# EasyEDA Pro project ProPrj_measure_boardd_2025-04-16.epro

# Schematic Schematic1
Board Name: Board1; Create Date: 2025-02-12; Page Name: P1; Project Name: measure_boardd; Schematic Name: Schematic1; Update Date: 2025-04-13; Company: EasyEDA.com; Page Size: A4; Version: V1.0
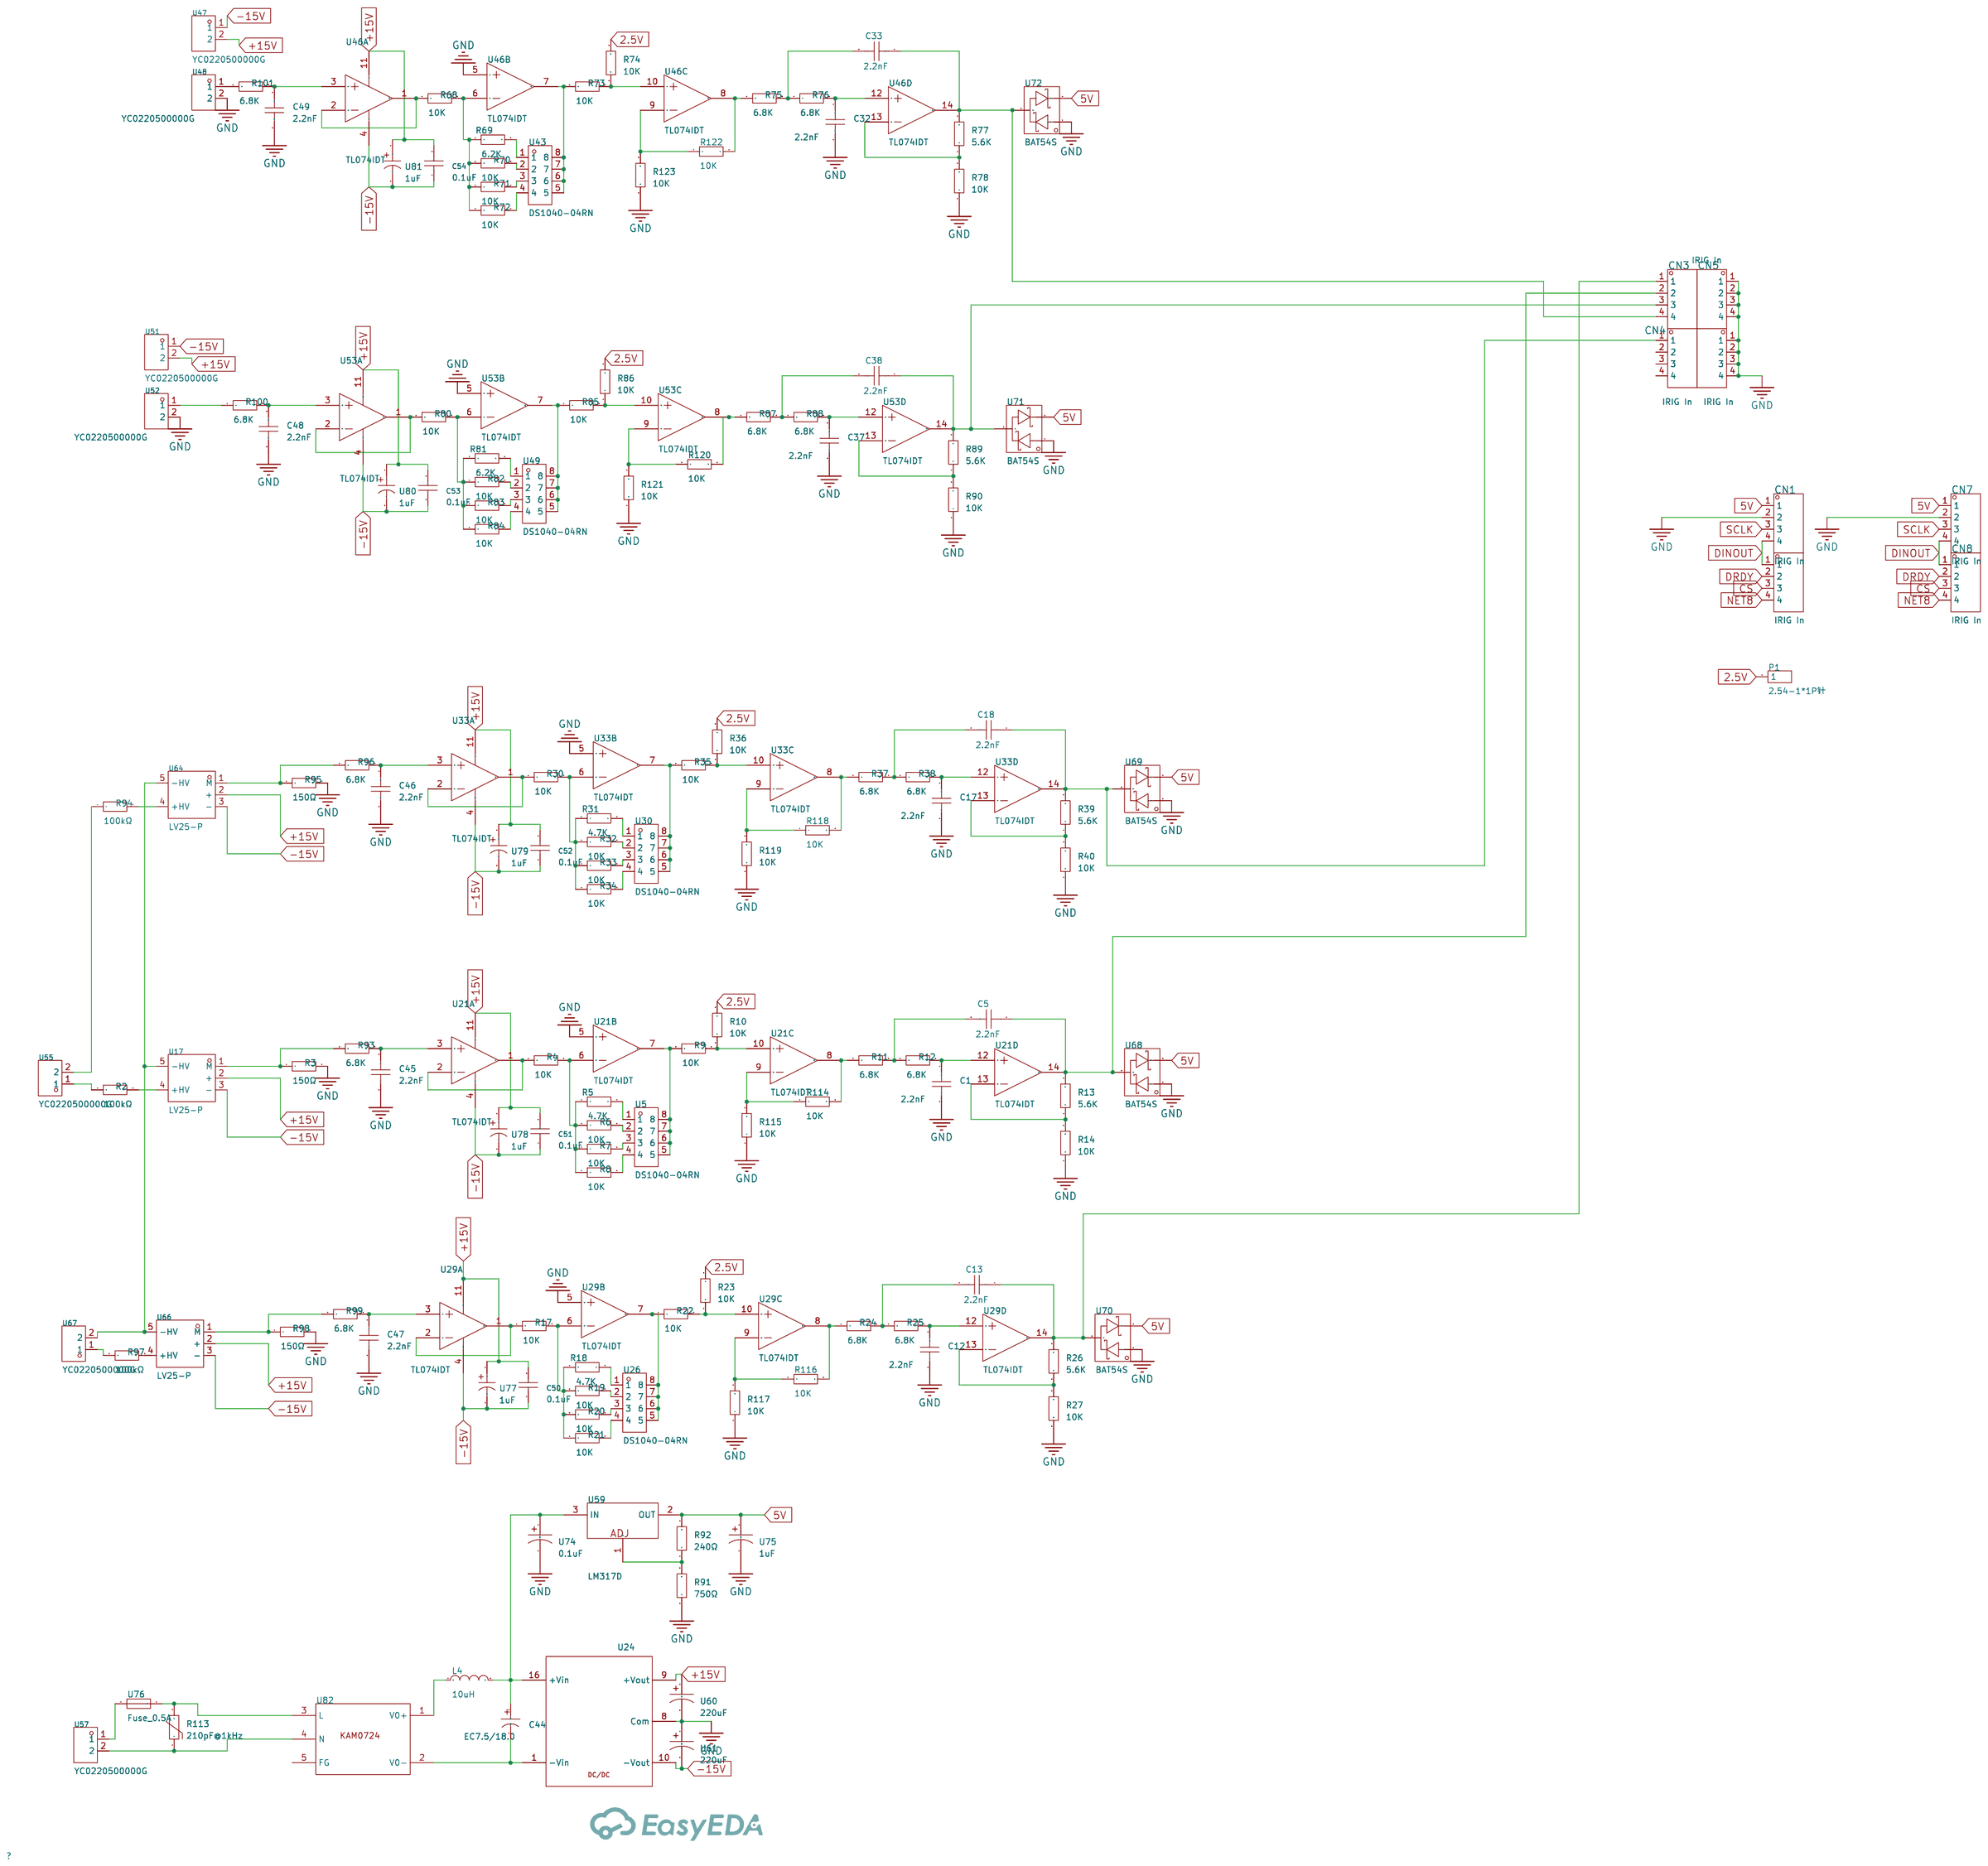
[diagram p0: schematic sheet]

## Parts
C1  2.2nF  [C0805]
C5  2.2nF  [C0805]
C12  2.2nF  [C0805]
C13  2.2nF  [C0805]
C17  2.2nF  [C0805]
C18  2.2nF  [C0805]
C32  2.2nF  [C0805]
C33  2.2nF  [C0805]
C37  2.2nF  [C0805]
C38  2.2nF  [C0805]
C44  EC7.5/18.0  [CAP-TH_BD18.0-P7.50-D1.2-FD]
C45  2.2nF  [C0805]
C46  2.2nF  [C0805]
C47  2.2nF  [C0805]
C48  2.2nF  [C0805]
C49  2.2nF  [C0805]
C50  0.1uF  [C0805]
C51  0.1uF  [C0805]
C52  0.1uF  [C0805]
C53  0.1uF  [C0805]
C54  0.1uF  [C0805]
CN1  IRIG In  [HDR-TH_04P-P2.54-V-M-2]
CN2  IRIG In  [HDR-TH_04P-P2.54-V-M-2]
CN3  IRIG In  [HDR-TH_04P-P2.54-V-M-2]
CN4  IRIG In  [HDR-TH_04P-P2.54-V-M-2]
CN5  IRIG In  [HDR-TH_04P-P2.54-V-M-2]
CN6  IRIG In  [HDR-TH_04P-P2.54-V-M-2]
CN7  IRIG In  [HDR-TH_04P-P2.54-V-M-2]
CN8  IRIG In  [HDR-TH_04P-P2.54-V-M-2]
L4  10uH  [IND-TH_BD9.0-P5.00-D0.7]
P1  2.54-1*1P针  [HDR-TH_1P-P2.54-V-M]
R2  100kΩ  [RES-TH_BD8.0-L24.5-P28.50-D0.8]
R3  150Ω  [R_AXIAL-0.4]
R4  10K  [R0603]
R5  4.7K  [R0603]
R6  10K  [R0603]
R7  10K  [R0603]
R8  10K  [R0603]
R9  10K  [R0603]
R10  10K  [R0603]
R11  6.8K  [R0603]
R12  6.8K  [R0603]
R13  5.6K  [R0603]
R14  10K  [R0603]
R17  10K  [R0603]
R18  4.7K  [R0603]
R19  10K  [R0603]
R20  10K  [R0603]
R21  10K  [R0603]
R22  10K  [R0603]
R23  10K  [R0603]
R24  6.8K  [R0603]
R25  6.8K  [R0603]
R26  5.6K  [R0603]
R27  10K  [R0603]
R30  10K  [R0603]
R31  4.7K  [R0603]
R32  10K  [R0603]
R33  10K  [R0603]
R34  10K  [R0603]
R35  10K  [R0603]
R36  10K  [R0603]
R37  6.8K  [R0603]
R38  6.8K  [R0603]
R39  5.6K  [R0603]
R40  10K  [R0603]
R68  10K  [R0603]
R69  6.2K  [R0603]
R70  10K  [R0603]
R71  10K  [R0603]
R72  10K  [R0603]
R73  10K  [R0603]
R74  10K  [R0603]
R75  6.8K  [R0603]
R76  6.8K  [R0603]
R77  5.6K  [R0603]
R78  10K  [R0603]
R80  10K  [R0603]
R81  6.2K  [R0603]
R82  10K  [R0603]
R83  10K  [R0603]
R84  10K  [R0603]
R85  10K  [R0603]
R86  10K  [R0603]
R87  6.8K  [R0603]
R88  6.8K  [R0603]
R89  5.6K  [R0603]
R90  10K  [R0603]
R91  750Ω  [R1210]
R92  240Ω  [R1210]
R93  6.8K  [R0603]
R94  100kΩ  [RES-TH_BD8.0-L24.5-P28.50-D0.8]
R95  150Ω  [R_AXIAL-0.4]
R96  6.8K  [R0603]
R97  100kΩ  [RES-TH_BD8.0-L24.5-P28.50-D0.8]
R98  150Ω  [R_AXIAL-0.4]
R99  6.8K  [R0603]
R100  6.8K  [R0603]
R101  6.8K  [R0603]
R113  210pF@1kHz  [RES-TH_L12.5-W5.1-P7.50-D1.2-S2.20]
R114  10K  [R0603]
R115  10K  [R0603]
R116  10K  [R0603]
R117  10K  [R0603]
R118  10K  [R0603]
R119  10K  [R0603]
R120  10K  [R0603]
R121  10K  [R0603]
R122  10K  [R0603]
R123  10K  [R0603]
U5  DS1040-04RN  [KEY-TH_DS1040-04RN]
U17  LV25-P  [SENSOR-TH_LV25-P]
U21  TL074IDT  [SOIC-14_L8.7-W3.9-P1.27-LS6.0-BL]  (sections 1,2,3,4)
U24  -  [TEL_8_SERIES]
U26  DS1040-04RN  [KEY-TH_DS1040-04RN]
U29  TL074IDT  [SOIC-14_L8.7-W3.9-P1.27-LS6.0-BL]  (sections 1,2,3,4)
U30  DS1040-04RN  [KEY-TH_DS1040-04RN]
U33  TL074IDT  [SOIC-14_L8.7-W3.9-P1.27-LS6.0-BL]  (sections 1,2,3,4)
U43  DS1040-04RN  [KEY-TH_DS1040-04RN]
U46  TL074IDT  [SOIC-14_L8.7-W3.9-P1.27-LS6.0-BL]  (sections 1,2,3,4)
U47  YC0220500000G  [CONN-TH_YC0220500000G]
U48  YC0220500000G  [CONN-TH_YC0220500000G]
U49  DS1040-04RN  [KEY-TH_DS1040-04RN]
U51  YC0220500000G  [CONN-TH_YC0220500000G]
U52  YC0220500000G  [CONN-TH_YC0220500000G]
U53  TL074IDT  [SOIC-14_L8.7-W3.9-P1.27-LS6.0-BL]  (sections 1,2,3,4)
U55  YC0220500000G  [CONN-TH_YC0220500000G]
U57  YC0220500000G  [CONN-TH_YC0220500000G]
U59  LM317D  [TO-252-2_L6.6-W6.1-P4.57-LS9.9-BR-CW]
U60  220uF  [CAP-TH_BD6.3-P2.50-D0.6-FD]
U61  220uF  [CAP-TH_BD6.3-P2.50-D0.6-FD]
U64  LV25-P  [SENSOR-TH_LV25-P]
U66  LV25-P  [SENSOR-TH_LV25-P]
U67  YC0220500000G  [CONN-TH_YC0220500000G]
U68  BAT54S  [SOT-23-3_L2.9-W1.3-P1.90-LS2.4-BR]
U69  BAT54S  [SOT-23-3_L2.9-W1.3-P1.90-LS2.4-BR]
U70  BAT54S  [SOT-23-3_L2.9-W1.3-P1.90-LS2.4-BR]
U71  BAT54S  [SOT-23-3_L2.9-W1.3-P1.90-LS2.4-BR]
U72  BAT54S  [SOT-23-3_L2.9-W1.3-P1.90-LS2.4-BR]
U74  0.1uF  [CAP-TH_BD6.3-P2.50-D0.6-FD]
U75  1uF  [CAP-TH_BD6.3-P2.50-D0.6-FD]
U76  Fuse_0.5A  [FUSE-TH_L8.9-W2.0-P5.00-D0.6-S0.80]
U77  1uF  [CAP-SMD_L3.5-W2.8-FD]
U78  1uF  [CAP-SMD_L3.5-W2.8-FD]
U79  1uF  [CAP-SMD_L3.5-W2.8-FD]
U80  1uF  [CAP-SMD_L3.5-W2.8-FD]
U81  1uF  [CAP-SMD_L3.5-W2.8-FD]
U82  -  [KAM0724]

## Library data of the parts
C1 C5 C12 C13 C17 C18 C32 C33 C37 C38 C45-C49 = CAP_0805: Supplier Footprint: 0805
C44 = EC7.5/18.0: Supplier Part: C9900017020; Supplier Footprint: 1000uF/63V；间距7.5mm外径18mm; JLCPCB Part Class: Extended Part; Supplier: LCSC
C50-C54 = CL21B105KBFNNNE: Capacitance: Tolerance:±10% Tolerance:±10% Voltage Rated: Temperature Coefficient:; LCSC Part Name: 1uF ±10% 50V; Supplier Part: C28323; Manufacturer: SAMSUNG(三星); Supplier Footprint: 0805; JLCPCB Part Class: Basic Part; Datasheet: https://atta.szlcsc.com/upload/public/pdf/source/20160218/1457707763339.pdf; Supplier: LCSC; Tolerance: ±10%
CN1-CN8 = IRIG In: Supplier: LCSC; Manufacturer Part: Headers  Pins2.54mm1*10P; image: http://image.lceda.cn/szlcsc/C57369.jpg; Supplier Part: C57369
L4 = PK0810-100MB: Inductance: Tolerance:±20% Tolerance:±20% Rated Current:3.2A DC Resistance (DCR):; LCSC Part Name: 10uH ±20%; Supplier Part: C19633499; Manufacturer: SXN(顺翔诺); Supplier Footprint: 插件,D9xL13mm; JLCPCB Part Class: Extended Part; Datasheet: https://atta.szlcsc.com/upload/public/pdf/source/20231215/67ADFEC92998B805DD4A41A71DD3C91A.pdf; Supplier: LCSC; Tolerance: ±20%; Rated Current: 3.2A
P1 = 2.54-1*1P针: Pin Structure:- Pitch:- Row Spacing:- Circluar Pins/Square Pins:- Mounting Type:Straight Number of Rows:Single Row Number of Pins:1P Current Rating:- Voltage Rating (Max):- Length of Mating Pin:- Insulation Height:- Contact Material:- Contact Plating:- Co; LCSC Part Name: 直插; Supplier Part: C81276; Manufacturer: BOOMELE(博穆精密); Supplier Footprint: 插件,P=2.54mm; JLCPCB Part Class: Extended Part; Datasheet: https://atta.szlcsc.com/upload/public/pdf/source/20221018/3E9408392E35E6F57A28985E5F7BF5C9.pdf; Supplier: LCSC; Mounting Type: Straight; Number of Rows: Single Row; Number of Pins: 1P; Color: Black
R2 R94 R97 = Res_AXIAL-5W: Supplier Footprint: Through
R3 R95 R98 = Res_AXIAL-1/4W: Supplier Footprint: Through
R4-R14 R17-R27 R30-R40 R68-R78 R80-R90 R93 R96 R99-R101 R114-R123 = Res_0603: Supplier Footprint: 0603
R91 R92 = Res_1210: Supplier Footprint: 1210
R113 = VDR-10D471K: Varistor Voltage:423V~517V Varistor Voltage:423V~517V Clamping Voltage: Maximum DC Volts: Maximum AC Volts: Peak Current: Energy:67J Energy:67J Capacitance:210pF@1kHz; LCSC Part Name: 钳位电压775V 67焦耳 插件压敏电阻; Supplier Part: C316609; Manufacturer: VDR(嵩隆); Supplier Footprint: 插件; JLCPCB Part Class: Extended Part; Datasheet: https://atta.szlcsc.com/upload/public/pdf/source/20210908/63B170955D01000DCFD7BF012F3B4797.pdf; Supplier: LCSC; Varistor Voltage: 423V~517V; Energy: 67J
U5 U26 U30 U43 U49 = DS1040-04RN: Number of Positions:4Bit Lead Pitch:2.54mm Color:Red; Supplier Part: C3024970; Manufacturer: CONNFLY; Supplier Footprint: 插件; JLCPCB Part Class: Extended Part; Datasheet: https://atta.szlcsc.com/upload/public/pdf/source/20220524/E487E22DEF95345BB2C3C9897C5E0C2D.pdf; Supplier: LCSC; Number of Positions: 4Bit; Lead Pitch: 2.54mm; Color: Red
U17 U64 U66 = LV25-P: Supplier Part: C453476; Manufacturer: LEM(莱姆); Supplier Footprint: 插件; JLCPCB Part Class: Extended Part; Datasheet: https://atta.szlcsc.com/upload/public/pdf/source/20200901/C453476_5BA3BC4F59636857A644FEC5A2FF2FFA.pdf; Supplier: LCSC
U21 U29 U33 U46 U53 = TL074IDT: Number of Circuits:Quad Gain Bandwidth Product(GBP):3MHz Current - Input Bias(Ib):20pA Voltage - Input Offset(Vos):3mV Slew Rate(SR):13V/us Supply Current Per Channel:1.4mA Operating Temperature:-40℃~+105℃ Operating Temperature:-40℃~+105℃; Supplier Part: C107644; Manufacturer: ST(意法半导体); Supplier Footprint: SOIC-14; JLCPCB Part Class: Extended Part; Datasheet: https://atta.szlcsc.com/upload/public/pdf/source/20180511/C79668_B9AF02D8BC6CC04960E26C1CA949D7C5.pdf; Supplier: LCSC; Number of Circuits: Quad; Gain Bandwidth Product(GBP): 3MHz; Current - Input Bias(Ib): 20pA; Voltage - Input Offset(Vos): 3mV; Slew Rate(SR): 13V/us; Supply Current Per Channel: 1.4mA; Operating Temperature: -40℃~+105℃
U24 = TEL_8-2423
U47 U48 U51 U52 U55 U57 U67 = YC0220500000G: Structure:1x2P Pitch:5.08mm Color:Green Mounting Style:Straight Current Rating (Max):10A Voltage Rating (Max):300V Number of Pins:2P Number of Rows:1 Wire Gauge - AWG:16~26 Wire Gauge - AWG:16~26 Number of PINs Per Row:2 Operating Temperature Range:-40℃~+; LCSC Part Name: 5.08mm 1x2P 排数:1 每排P数:2 直插; Supplier Part: C2683165; Manufacturer: Amphenol; Supplier Footprint: 插件,P=5.08mm; JLCPCB Part Class: Extended Part; Datasheet: https://atta.szlcsc.com/upload/public/pdf/source/20210329/C2683165_184F37C3428385EA6CBC65FCC2B0FE9A.pdf; Supplier: LCSC; Structure: 1x2P; Pitch: 5.08mm; Color: Green; Mounting Style: Straight; Current Rating (Max): 10A; Voltage Rating (Max): 300V; Number of Pins: 2P; Number of Rows: 1; Wire Gauge - AWG: 16~26; Number of PINs Per Row: 2; Operating Temperature Range: -40℃~+115℃
U59 = LM317D: Output Type:Adjustable Maximum Input Voltage:- Output Voltage:1.2V~37V Output Voltage:1.2V~37V Output Current:1.5A Power Supply Rejection Ratio (PSRR):80dB@(120Hz) Operating Temperature:0℃~+125℃@(Tj) Operating Temperature:0℃~+125℃@(Tj) Output Polarity:Pos; Supplier Part: C19273122; Manufacturer: YFW(佑风微); Supplier Footprint: TO-252; JLCPCB Part Class: Extended Part; Datasheet: https://atta.szlcsc.com/upload/public/pdf/source/20231201/418A6F2C5017D5AE5FD34272C42A6510.pdf; Supplier: LCSC; Output Type: Adjustable; Output Voltage: 1.2V~37V; Output Current: 1.5A; Power Supply Rejection Ratio (PSRR): 80dB@(120Hz); Operating Temperature: 0℃~+125℃@(Tj); Output Polarity: Positive electrode; Number of Outputs: 1
U60 U61 U74 U75 = 25V220uF CD288: Capacitance: Tolerance:±20% Tolerance:±20% Rated Voltage: Lead Spacing: φD: L: Operating Temperature:-40℃~+105℃ Operating Temperature:-40℃~+105℃; LCSC Part Name: 220uF ±20% 25V; Supplier Part: C2960221; Manufacturer: HRK(鸿瑞凯电子); Supplier Footprint: 插件,D6.3xL12mm; JLCPCB Part Class: Extended Part; Datasheet: https://atta.szlcsc.com/upload/public/pdf/source/20220224/4E62C25599E7046827B6B2B120EB46F9.pdf; Supplier: LCSC; Tolerance: ±20%; Operating Temperature: -40℃~+105℃
U68-U72 = BAT54S_C22374724: Supplier Part: C22374724; Manufacturer: DOWO(东沃); Supplier Footprint: SOT-23; JLCPCB Part Class: Extended Part; Datasheet: https://atta.szlcsc.com/upload/public/pdf/source/20240402/00E7935314739AA8A2B57AD1567A1D2C.pdf; Supplier: LCSC
U76 = Fuse_0.5A: Supplier Part: C9900015003; Supplier Footprint: FUSE_200MIL; JLCPCB Part Class: Extended Part; Supplier: LCSC
U77-U81 = CA45B-B-50V-1UF-K: Capacitance:1uF Tolerance:±10% Tolerance:±10% Voltage Rating:50V Current - Leakage:500nA@25°C,5min Ripple Current:- Equivalent Series Resistance(ESR):6Ω@100kHz Operating Temperature:-55℃~+125℃ Operating Temperature:-55℃~+125℃; LCSC Part Name: 1uF ±10% 50V; Supplier Part: C3202852; Manufacturer: CEC(振华新云); Supplier Footprint: CASE-B-3528-19(mm); JLCPCB Part Class: Extended Part; Datasheet: https://atta.szlcsc.com/upload/public/pdf/source/20220331/9EC1019083AD796DA5C9626021BE8B57.pdf; Supplier: LCSC; Tolerance: ±10%; Voltage Rating: 50V; Current - Leakage: 500nA@25°C,5min; Equivalent Series Resistance(ESR): 6Ω@100kHz; Operating Temperature: -55℃~+125℃
U82 = KAM0724_ver3

## Nets
2.5V: P1.1 R10.2 R23.2 R36.2 R74.2 R86.2
5V: CN1.1 CN7.1 R92.2 U59.2(OUT) U68.2 U69.2 U70.2 U71.2 U72.2 U75.1
+15V: C50.2 C51.2 C52.2 C53.2 C54.2 U17.2(+) U21.11(VCC-) U24.9(+Vout) U29.11(VCC-) U33.11(VCC-) U46.11(VCC-) U47.2 U51.2 U53.11(VCC-) U60.1 U64.2(+) U66.2(+) U77.1 U78.1 U79.1 U80.1 U81.1
-15V: C50.1 C51.1 C52.1 C53.1 C54.1 U17.3(-) U21.4(VCC+) U24.10(-Vout) U29.4(VCC+) U33.4(VCC+) U46.4(VCC+) U47.1 U51.1 U53.4(VCC+) U61.2 U64.3(-) U66.3(-) U77.2 U78.2 U79.2 U80.2 U81.2
GND: C1.2 C12.2 C17.2 C32.2 C37.2 C45.2 C46.2 C47.2 C48.2 C49.2 CN1.2 CN5.1 CN5.2 CN5.3 CN5.4 CN6.1 CN6.2 CN6.3 CN6.4 CN7.2 R3.2 R14.1 R27.1 R40.1 R78.1 R90.1 R91.1 R95.2 R98.2 R115.1 R117.1 R119.1 R121.1 R123.1 U21.5(2IN+) U24.8(Com) U29.5(2IN+) U33.5(2IN+) U46.5(2IN+) U48.2 U52.2 U53.5(2IN+) U60.2 U61.1 U68.1 U69.1 U70.1 U71.1 U72.1 U74.2 U75.2
CS: CN2.3 CN8.3
DINOUT: CN1.4 CN2.1 CN7.4 CN8.1
DRDY: CN2.2 CN8.2
NET8: CN2.4 CN8.4
SCLK: CN1.3 CN7.3
$1N1815: R3.1 R93.1 U17.1(M)
$1N1976: R4.1 U21.1(1OUT) U21.2(1IN-)
$1N2054: R5.2 U5.1
$1N2080: R6.2 U5.2
$1N2106: R7.2 U5.3
$1N2182: R8.2 U5.4
$1N2231: R9.1 U5.5 U5.6 U5.7 U5.8 U21.7(2OUT)
$1N2651: R9.2 R10.1 U21.10(3IN+)
$1N3069: C5.2 R11.2 R12.1
$1N3119: C1.1 R12.2 U21.12(4IN+)
$1N3183: R13.1 R14.2 U21.13(4IN-)
$1N3559: R4.2 R5.1 R6.1 R7.1 R8.1 U21.6(2IN-)
$1N4476: C5.1 CN3.2 R13.2 U21.14(4OUT) U68.3
$1N5599: U57.1 U76.1
$1N5603: R113.1 U57.2 U82.4(N)
$1N6524: R17.2 R18.1 R19.1 R20.1 R21.1 U29.6(2IN-)
$1N6525: R18.2 U26.1
$1N6527: R22.1 U26.5 U26.6 U26.7 U26.8 U29.7(2OUT)
$1N6528: R20.2 U26.3
$1N6529: R19.2 U26.2
$1N6533: R21.2 U26.4
$1N6536: R17.1 U29.1(1OUT) U29.2(1IN-)
$1N6538: R22.2 R23.1 U29.10(3IN+)
$1N6541: C13.1 CN3.1 R26.2 U29.14(4OUT) U70.3
$1N6548: R26.1 R27.2 U29.13(4IN-)
$1N6553: C13.2 R24.2 R25.1
$1N6559: C12.1 R25.2 U29.12(4IN+)
$1N7416: R30.2 R31.1 R32.1 R33.1 R34.1 U33.6(2IN-)
$1N7417: R31.2 U30.1
$1N7419: R35.1 U30.5 U30.6 U30.7 U30.8 U33.7(2OUT)
$1N7420: R33.2 U30.3
$1N7421: R32.2 U30.2
$1N7425: R34.2 U30.4
$1N7428: R30.1 U33.1(1OUT) U33.2(1IN-)
$1N7430: R35.2 R36.1 U33.10(3IN+)
$1N7440: R39.1 R40.2 U33.13(4IN-)
$1N7445: C18.2 R37.2 R38.1
$1N7451: C17.1 R38.2 U33.12(4IN+)
$1N10154: R72.2 U43.4
$1N10155: R68.2 R69.1 R70.1 R71.1 R72.1 U46.6(2IN-)
$1N10156: R73.1 U43.5 U43.6 U43.7 U43.8 U46.7(2OUT)
$1N10157: R71.2 U43.3
$1N10158: R70.2 U43.2
$1N10167: C33.2 R75.2 R76.1
$1N10180: R69.2 U43.1
$1N10182: R68.1 U46.1(1OUT) U46.2(1IN-)
$1N10186: R77.1 R78.2 U46.13(4IN-)
$1N10198: C32.1 R76.2 U46.12(4IN+)
$1N10199: R73.2 R74.1 U46.10(3IN+)
$1N17336: R113.2 U76.2 U82.3(L)
$1N20202: R80.1 U53.1(1OUT) U53.2(1IN-)
$1N20203: R81.2 U49.1
$1N20204: R82.2 U49.2
$1N20205: R83.2 U49.3
$1N20206: R84.2 U49.4
$1N20207: R85.1 U49.5 U49.6 U49.7 U49.8 U53.7(2OUT)
$1N20209: R85.2 R86.1 U53.10(3IN+)
$1N20211: C38.2 R87.2 R88.1
$1N20212: C37.1 R88.2 U53.12(4IN+)
$1N20213: R89.1 R90.2 U53.13(4IN-)
$1N20216: R80.2 R81.1 R82.1 R83.1 R84.1 U53.6(2IN-)
$1N20370: R2.1 U55.1
$1N20734: R91.2 R92.1 U59.1(ADJ)
$1N23806: C44.2 U24.1(-Vin) U82.2(V0-)
$1N36258: L4.1 U82.1(V0+)
$1N36284: C44.1 L4.2 U24.16(+Vin) U59.3(IN) U74.1
$1N41392: C45.1 R93.2 U21.3(1IN+)
$1N41681: C46.1 R96.2 U33.3(1IN+)
$1N41683: U17.5(-HV) U64.5(-HV) U66.5(-HV) U67.2
$1N41685: R95.1 R96.1 U64.1(M)
$1N42087: R98.1 R99.1 U66.1(M)
$1N42093: R97.2 U66.4(+HV)
$1N42100: C47.1 R99.2 U29.3(1IN+)
$1N42167: C48.1 R100.2 U53.3(1IN+)
$1N42170: R100.1 U52.1
$1N42233: C49.1 R101.2 U46.3(1IN+)
$1N42236: R101.1 U48.1
$1N84415: R94.2 U64.4(+HV)
$1N84418: R94.1 U55.2
$1N84441: R2.2 U17.4(+HV)
$1N84474: R97.1 U67.1
$1N102670: C18.1 CN4.1 R39.2 U33.14(4OUT) U69.3
$1N108532: C33.1 CN3.4 R77.2 U46.14(4OUT) U72.3
$1N108540: C38.1 CN3.3 R89.2 U53.14(4OUT) U71.3
$1N114348: R114.1 R115.2 U21.9(3IN-)
$1N114352: R11.1 R114.2 U21.8(3OUT)
$1N114492: R116.1 R117.2 U29.9(3IN-)
$1N114496: R24.1 R116.2 U29.8(3OUT)
$1N114708: R122.1 R123.2 U46.9(3IN-)
$1N114712: R75.1 R122.2 U46.8(3OUT)
$1N114721: R120.1 R121.2 U53.9(3IN-)
$1N114725: R87.1 R120.2 U53.8(3OUT)
$1N114740: R118.1 R119.2 U33.9(3IN-)
$1N114744: R37.1 R118.2 U33.8(3OUT)

Not connected (* = marked no-connect by the designer): CN4 2 3 4; U82 5(FG)

# Board PCB1
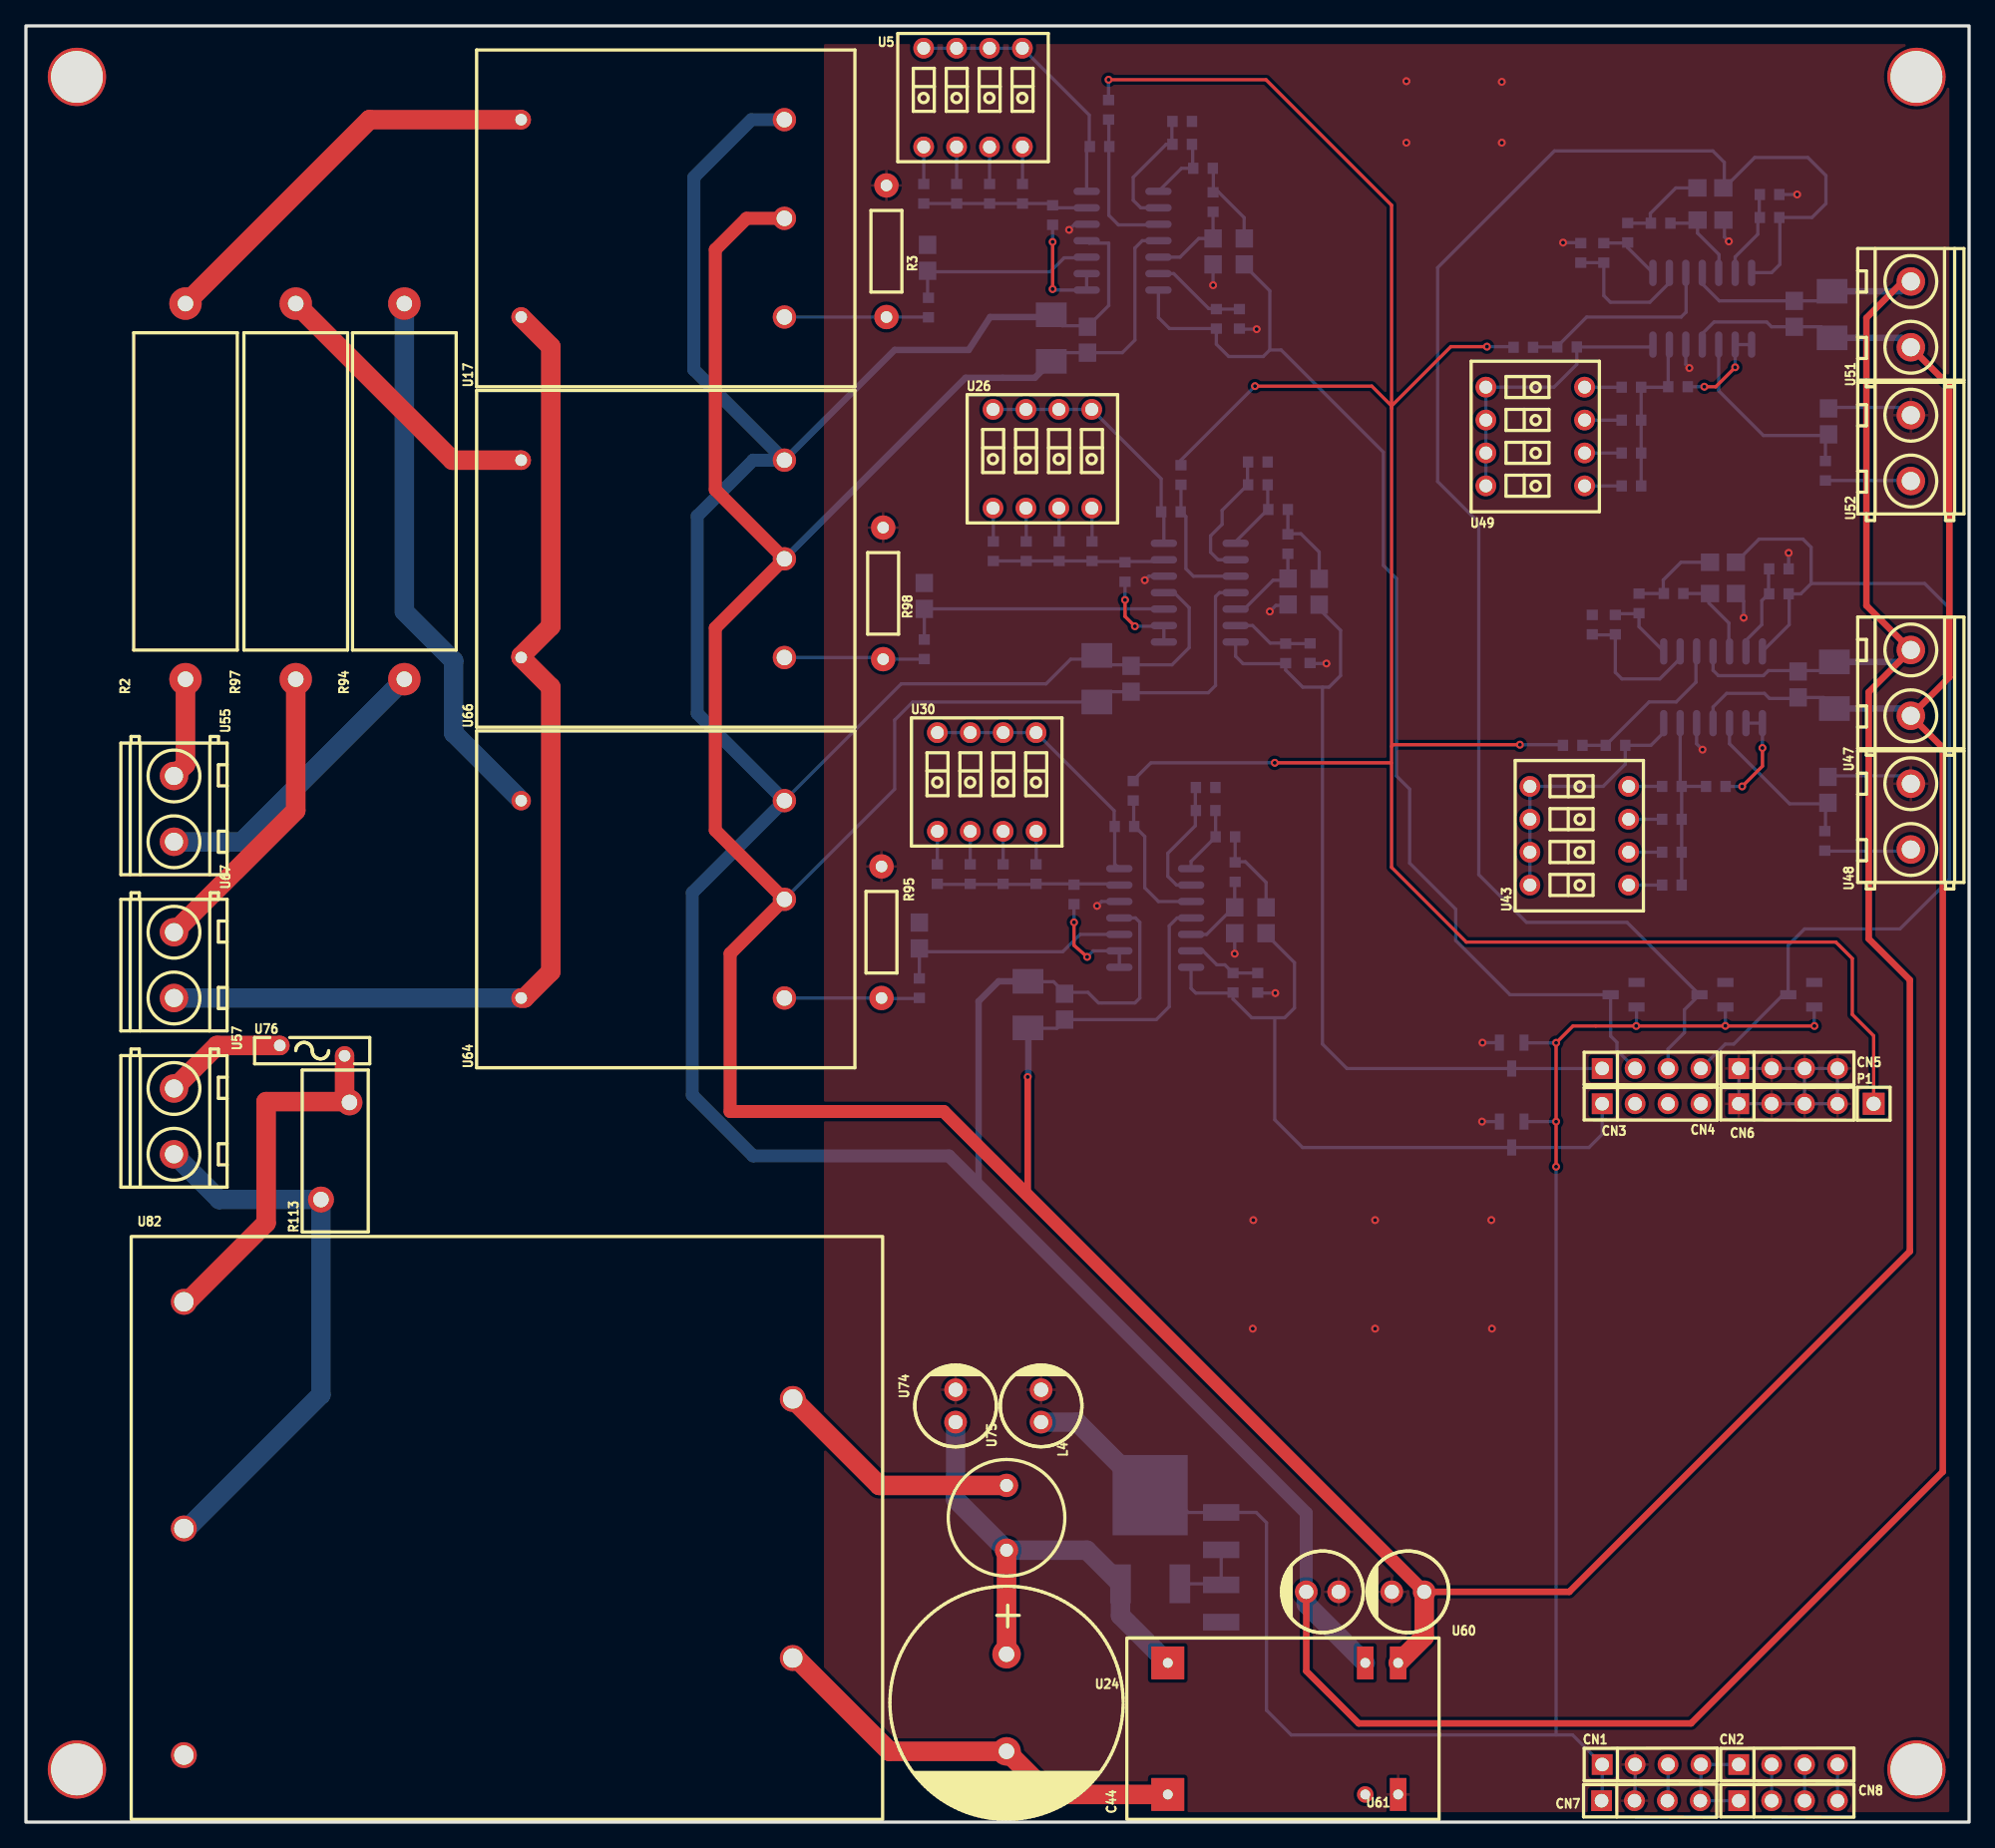
[diagram p1: board, top side]
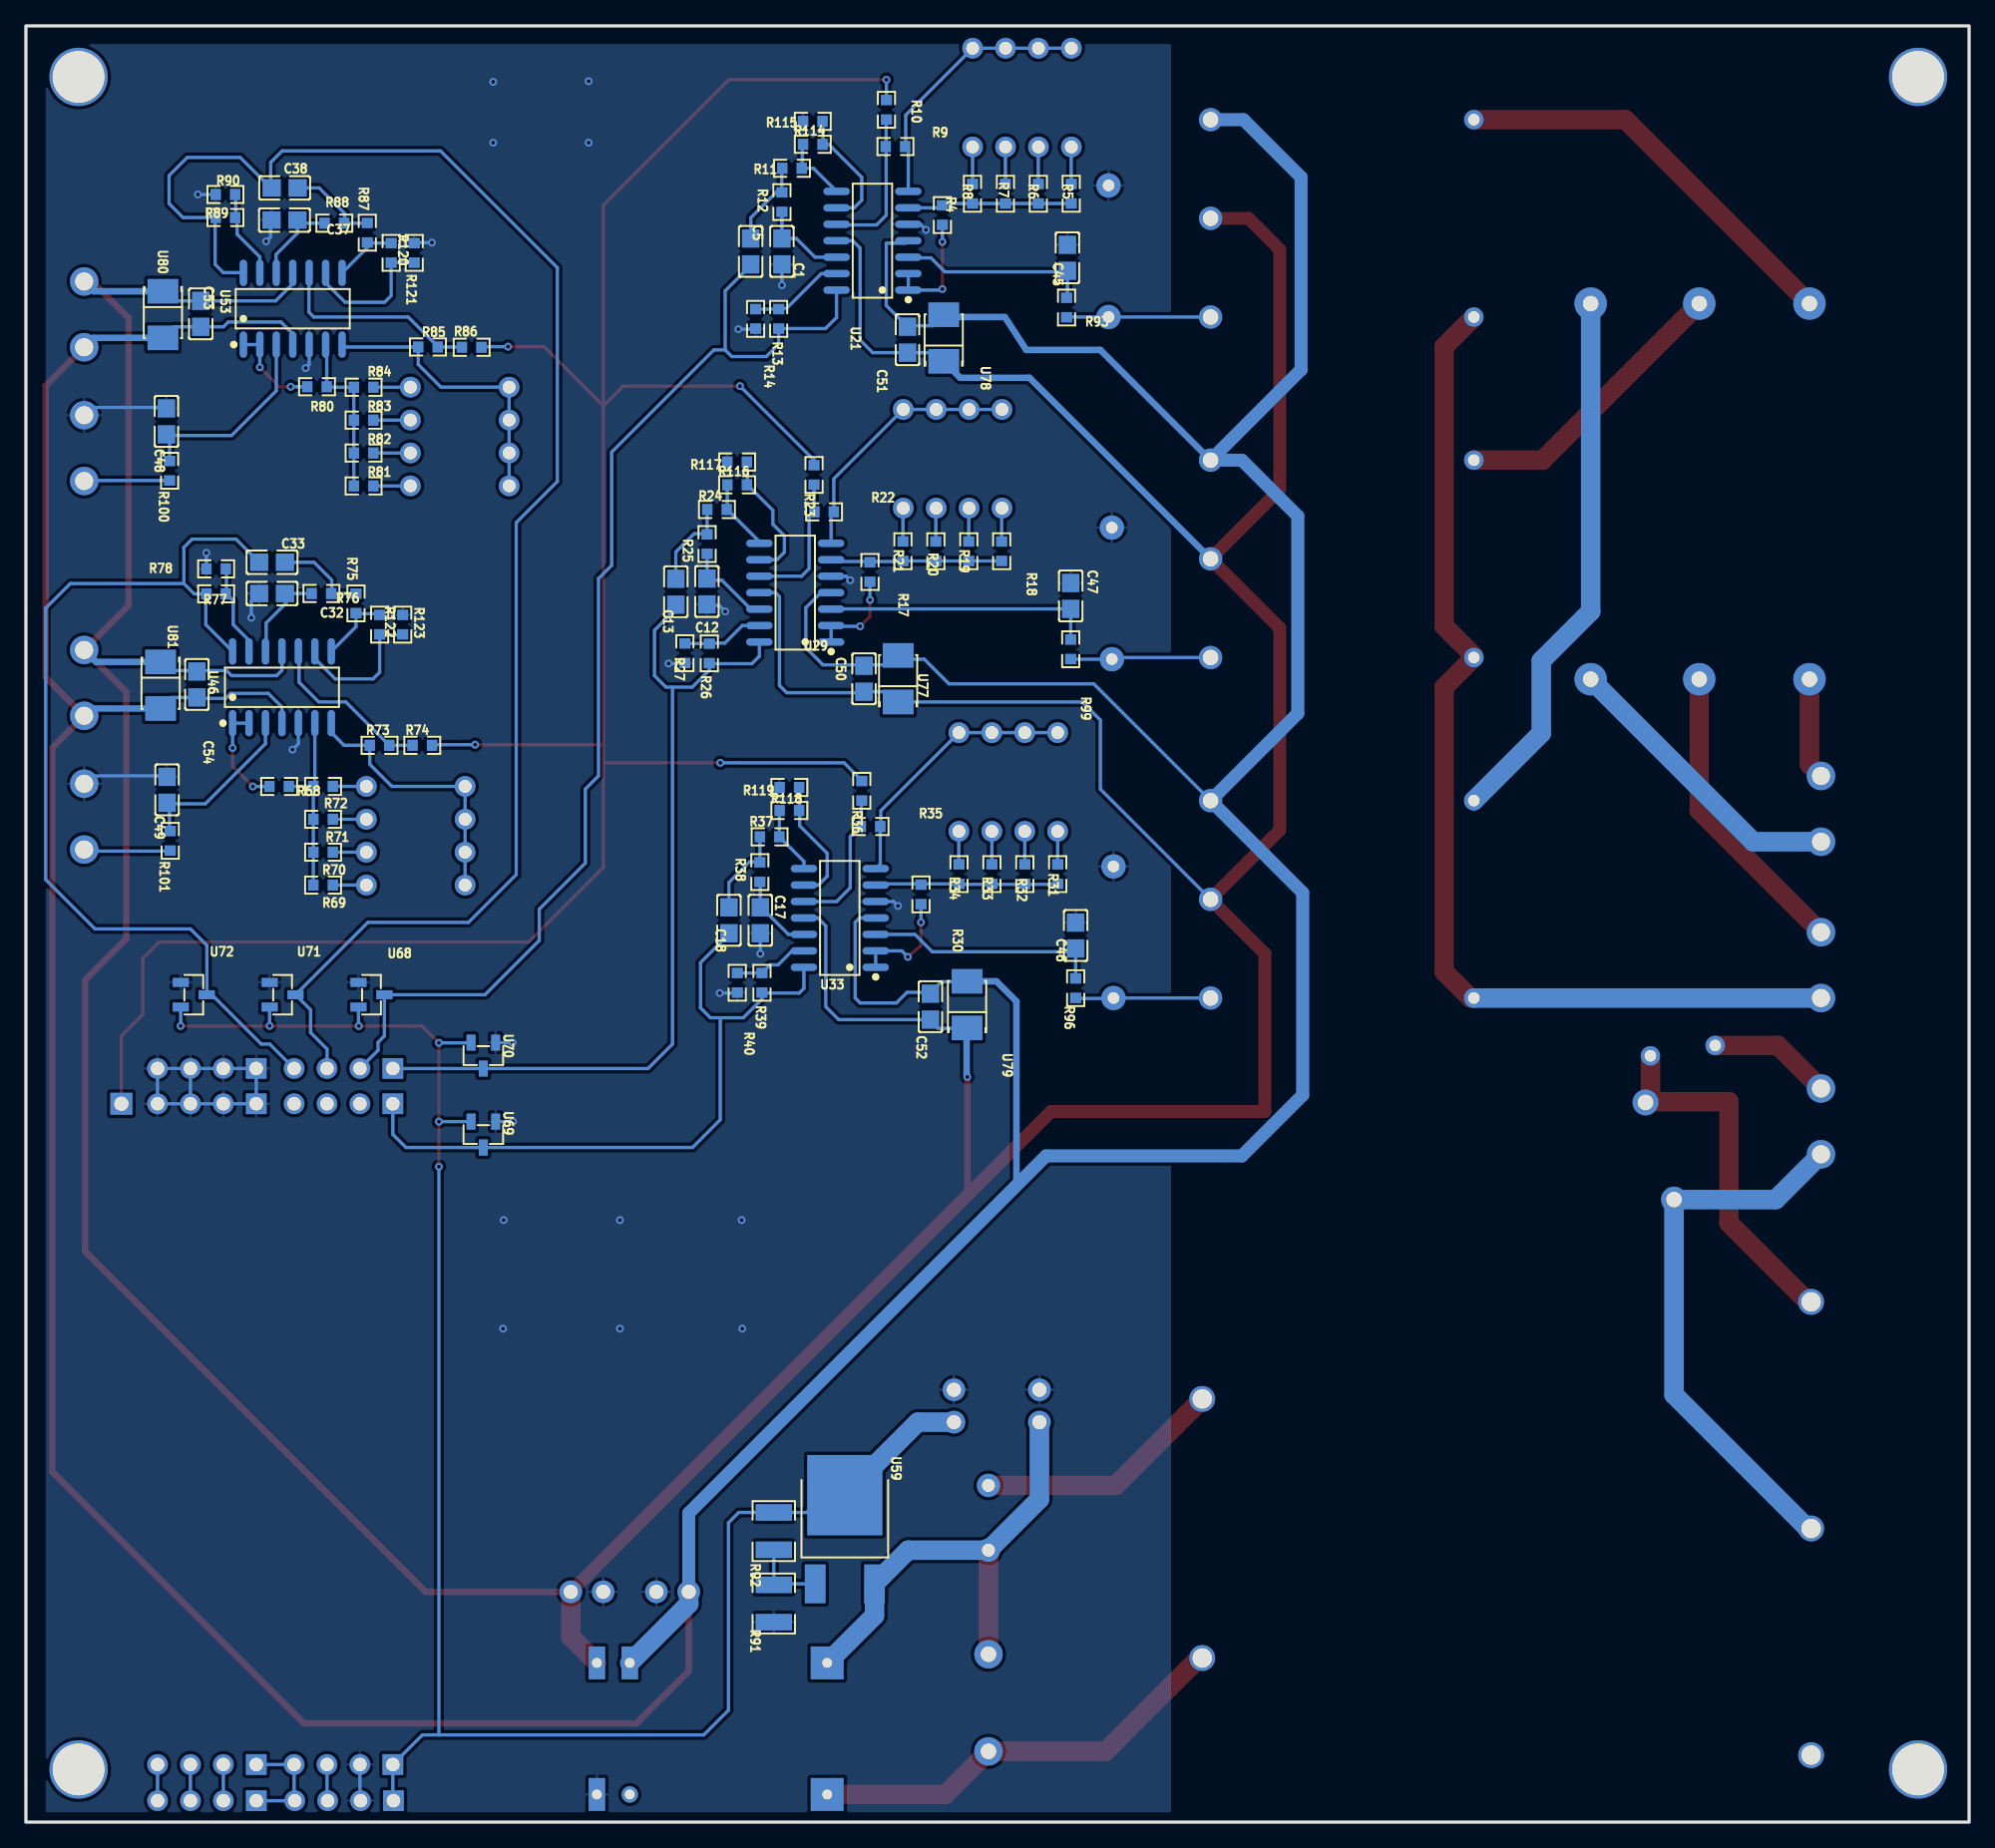
[diagram p2: board, bottom side, seen from below]

Outline 149.99 x 138.68 mm; copper layers: Top Layer, Bottom Layer. Coordinates in mm from the lower left corner of the outline.
Outline path: rectangle 0,138.68 149.99,0
Stack: Top Layer 0.035mm / Dielectric1 1.51mm FR4 er 4.5 / Bottom Layer 0.035mm

## Design rules (mm)
template: JLCPCB Capability(Two Layers Board)
spacing copperThickness1oz (default): track to track 0.102, other pairs 0.152 to 0.3
spacing copperThickness2oz: track to track 0.203, other pairs 0.152 to 0.3
track width copperThickness1oz (default): min 0.127, default 0.254, max 2.54
track width copperThickness2oz: min 0.203, default 0.254, max 2.54
differential pair differentialPair (default): width min 0.127, default 0.254, max 2.54; gap min 0.152, default 0.152
via viaSize (default): diameter min 0.5, default 0.61, max 10; hole min 0.3, default 0.305, max 6.3

## Placement (name value [footprint] x y rotation side)
C1  2.2nF  [C0805]  91.63 121.27 270 bottom
C5  2.2nF  [C0805]  94.05 121.27 90 bottom
C12  2.2nF  [C0805]  97.42 95.02 270 bottom
C13  2.2nF  [C0805]  99.82 95 90 bottom
C17  2.2nF  [C0805]  93.3 69.63 270 bottom
C18  2.2nF  [C0805]  95.72 69.63 90 bottom
C32  2.2nF  [C0805]  130.99 94.86 0 bottom
C33  2.2nF  [C0805]  130.99 97.27 180 bottom
C37  2.2nF  [C0805]  130.03 123.69 0 bottom
C38  2.2nF  [C0805]  130.01 126.17 180 bottom
C44  EC7.5/18.0  [CAP-TH_BD18.0-P7.50-D1.2-FD]  75.69 9.21 270 top
C45  2.2nF  [C0805]  69.6 120.78 90 bottom
C46  2.2nF  [C0805]  68.96 68.45 90 bottom
C47  2.2nF  [C0805]  69.34 94.67 90 bottom
C48  2.2nF  [C0805]  139.14 108.15 90 bottom
C49  2.2nF  [C0805]  139.09 79.7 90 bottom
C50  0.1uF  [C0805]  85.3 88.28 270 bottom
C51  0.1uF  [C0805]  81.94 114.46 270 bottom
C52  0.1uF  [C0805]  80.17 62.96 270 bottom
C53  0.1uF  [C0805]  136.49 116.45 90 bottom
C54  0.1uF  [C0805]  136.79 87.84 90 bottom
CN1  IRIG In  [HDR-TH_04P-P2.54-V-M-2]  126.75 4.44 0 top
CN2  IRIG In  [HDR-TH_04P-P2.54-V-M-2]  137.29 4.44 0 top
CN3  IRIG In  [HDR-TH_04P-P2.54-V-M-2]  126.75 58.19 0 top
CN4  IRIG In  [HDR-TH_04P-P2.54-V-M-2]  126.75 55.46 0 top
CN5  IRIG In  [HDR-TH_04P-P2.54-V-M-2]  137.29 58.19 0 top
CN6  IRIG In  [HDR-TH_04P-P2.54-V-M-2]  137.29 55.46 0 top
CN7  IRIG In  [HDR-TH_04P-P2.54-V-M-2]  126.7 1.65 0 top
CN8  IRIG In  [HDR-TH_04P-P2.54-V-M-2]  137.29 1.65 0 top
L4  10uH  [IND-TH_BD9.0-P5.00-D0.7]  75.69 23.5 270 top
NOREF  -  [Pad_e222]  3.94 4.06 0 top
NOREF#2  -  [Pad_e221]  145.92 4.06 0 top
NOREF#3  -  [Pad_e224]  145.92 134.75 0 top
NOREF#4  -  [Pad_e223]  3.94 134.75 0 top
P1  2.54-1*1P针  [HDR-TH_1P-P2.54-V-M]  142.62 55.46 0 top
R2  100kΩ  [RES-TH_BD8.0-L24.5-P28.50-D0.8]  12.32 102.74 90 top
R3  150Ω  [R_AXIAL-0.4]  66.42 121.28 90 top
R4  10K  [R0603]  79.25 124.08 90 bottom
R5  4.7K  [R0603]  69.3 125.72 90 bottom
R6  10K  [R0603]  71.84 125.72 90 bottom
R7  10K  [R0603]  74.38 125.72 90 bottom
R8  10K  [R0603]  76.92 125.72 90 bottom
R9  10K  [R0603]  82.87 129.37 0 bottom
R10  10K  [R0603]  83.57 132.21 90 bottom
R11  6.8K  [R0603]  90.86 127.69 0 bottom
R12  6.8K  [R0603]  91.63 125.08 270 bottom
R13  5.6K  [R0603]  91.89 116.06 270 bottom
R14  10K  [R0603]  93.66 116.06 90 bottom
R17  10K  [R0603]  84.84 96.52 90 bottom
R18  4.7K  [R0603]  74.67 98.12 90 bottom
R19  10K  [R0603]  77.21 98.12 90 bottom
R20  10K  [R0603]  79.75 98.12 90 bottom
R21  10K  [R0603]  82.29 98.12 90 bottom
R22  10K  [R0603]  88.38 101.17 0 bottom
R23  10K  [R0603]  89.15 104.01 90 bottom
R24  6.8K  [R0603]  96.65 101.35 0 bottom
R25  6.8K  [R0603]  97.41 98.68 270 bottom
R26  5.6K  [R0603]  97.24 90.24 270 bottom
R27  10K  [R0603]  99.12 90.25 90 bottom
R30  10K  [R0603]  80.9 71.63 90 bottom
R31  4.7K  [R0603]  70.35 73.2 90 bottom
R32  10K  [R0603]  72.89 73.2 90 bottom
R33  10K  [R0603]  75.43 73.2 90 bottom
R34  10K  [R0603]  77.97 73.2 90 bottom
R35  10K  [R0603]  84.79 76.87 0 bottom
R36  10K  [R0603]  85.47 79.63 90 bottom
R37  6.8K  [R0603]  92.58 76.07 0 bottom
R38  6.8K  [R0603]  93.34 73.35 270 bottom
R39  5.6K  [R0603]  93.17 64.8 270 bottom
R40  10K  [R0603]  95.08 64.8 90 bottom
R68  10K  [R0603]  130.44 79.96 180 bottom
R69  6.2K  [R0603]  127.05 72.35 180 bottom
R70  10K  [R0603]  127.05 74.89 180 bottom
R71  10K  [R0603]  127.05 77.43 180 bottom
R72  10K  [R0603]  127.05 79.97 180 bottom
R73  10K  [R0603]  122.69 83.14 180 bottom
R74  10K  [R0603]  119.39 83.14 180 bottom
R75  6.8K  [R0603]  124.51 94.1 90 bottom
R76  6.8K  [R0603]  127.18 94.86 0 bottom
R77  5.6K  [R0603]  135.31 94.83 0 bottom
R78  10K  [R0603]  135.31 96.76 180 bottom
R80  10K  [R0603]  127.52 110.82 180 bottom
R81  6.2K  [R0603]  123.92 103.17 180 bottom
R82  10K  [R0603]  123.92 105.71 180 bottom
R83  10K  [R0603]  123.92 108.25 180 bottom
R84  10K  [R0603]  123.92 110.79 180 bottom
R85  10K  [R0603]  118.95 113.89 180 bottom
R86  10K  [R0603]  115.58 113.87 180 bottom
R87  6.8K  [R0603]  123.64 122.72 90 bottom
R88  6.8K  [R0603]  126.18 123.45 0 bottom
R89  5.6K  [R0603]  134.59 123.89 0 bottom
R90  10K  [R0603]  134.59 125.67 180 bottom
R91  750Ω  [R1210]  92.26 16.88 90 bottom
R92  240Ω  [R1210]  92.26 22.47 90 bottom
R93  6.8K  [R0603]  69.66 116.94 90 bottom
R94  100kΩ  [RES-TH_BD8.0-L24.5-P28.50-D0.8]  29.21 102.74 90 top
R95  150Ω  [R_AXIAL-0.4]  66.04 68.71 90 top
R96  6.8K  [R0603]  68.96 64.39 90 bottom
R97  100kΩ  [RES-TH_BD8.0-L24.5-P28.50-D0.8]  20.83 102.74 90 top
R98  150Ω  [R_AXIAL-0.4]  66.17 94.87 90 top
R99  6.8K  [R0603]  69.34 90.55 90 bottom
R100  6.8K  [R0603]  138.9 104.34 90 bottom
R101  6.8K  [R0603]  138.85 75.76 90 bottom
R113  210pF@1kHz  [RES-TH_L12.5-W5.1-P7.50-D1.2-S2.20]  23.88 51.82 90 top
R114  10K  [R0603]  89.25 129.54 0 bottom
R115  10K  [R0603]  89.25 131.31 180 bottom
R116  10K  [R0603]  95.09 103.25 0 bottom
R117  10K  [R0603]  95.09 105.01 180 bottom
R118  10K  [R0603]  91.06 78.11 0 bottom
R119  10K  [R0603]  91.06 79.88 180 bottom
R120  10K  [R0603]  121.79 121.16 90 bottom
R121  10K  [R0603]  120.02 121.16 270 bottom
R122  10K  [R0603]  122.68 92.46 90 bottom
R123  10K  [R0603]  120.9 92.46 270 bottom
U5  DS1040-04RN  [KEY-TH_DS1040-04RN]  73.1 133.15 0 top
U17  LV25-P  [SENSOR-TH_LV25-P]  48.39 123.83 90 top
U21  TL074IDT  [SOIC-14_L8.7-W3.9-P1.27-LS6.0-BL]  84.65 122.1 90 bottom
U24  -  [TEL_8_SERIES]  88.14 7.21 0 top
U26  DS1040-04RN  [KEY-TH_DS1040-04RN]  78.46 105.26 0 top
U29  TL074IDT  [SOIC-14_L8.7-W3.9-P1.27-LS6.0-BL]  90.6 94.93 90 bottom
U30  DS1040-04RN  [KEY-TH_DS1040-04RN]  74.16 80.31 0 top
U33  TL074IDT  [SOIC-14_L8.7-W3.9-P1.27-LS6.0-BL]  87.17 69.81 90 bottom
U43  DS1040-04RN  [KEY-TH_DS1040-04RN]  119.9 76.16 90 top
U46  TL074IDT  [SOIC-14_L8.7-W3.9-P1.27-LS6.0-BL]  130.23 87.62 180 bottom
U47  YC0220500000G  [CONN-TH_YC0220500000G]  145.49 87.96 90 top
U48  YC0220500000G  [CONN-TH_YC0220500000G]  145.49 77.63 90 top
U49  DS1040-04RN  [KEY-TH_DS1040-04RN]  116.5 106.98 90 top
U51  YC0220500000G  [CONN-TH_YC0220500000G]  145.49 116.41 90 top
U52  YC0220500000G  [CONN-TH_YC0220500000G]  145.49 106.08 90 top
U53  TL074IDT  [SOIC-14_L8.7-W3.9-P1.27-LS6.0-BL]  129.39 116.85 180 bottom
U55  YC0220500000G  [CONN-TH_YC0220500000G]  11.43 78.23 270 top
U57  YC0220500000G  [CONN-TH_YC0220500000G]  11.43 54.1 270 top
U59  LM317D  [TO-252-2_L6.6-W6.1-P4.57-LS9.9-BR-CW]  86.78 21.82 270 bottom
U60  220uF  [CAP-TH_BD6.3-P2.50-D0.6-FD]  106.68 17.78 180 top
U61  220uF  [CAP-TH_BD6.3-P2.50-D0.6-FD]  100.08 17.78 180 top
U64  LV25-P  [SENSOR-TH_LV25-P]  48.39 71.25 90 top
U66  LV25-P  [SENSOR-TH_LV25-P]  48.39 97.54 90 top
U67  YC0220500000G  [CONN-TH_YC0220500000G]  11.43 66.17 270 top
U68  BAT54S  [SOT-23-3_L2.9-W1.3-P1.90-LS2.4-BR]  123.32 63.88 0 bottom
U69  BAT54S  [SOT-23-3_L2.9-W1.3-P1.90-LS2.4-BR]  114.68 53.09 90 bottom
U70  BAT54S  [SOT-23-3_L2.9-W1.3-P1.90-LS2.4-BR]  114.68 59.18 90 bottom
U71  BAT54S  [SOT-23-3_L2.9-W1.3-P1.90-LS2.4-BR]  130.18 63.88 0 bottom
U72  BAT54S  [SOT-23-3_L2.9-W1.3-P1.90-LS2.4-BR]  137.03 63.88 0 bottom
U74  0.1uF  [CAP-TH_BD6.3-P2.50-D0.6-FD]  71.76 32.13 90 top
U75  1uF  [CAP-TH_BD6.3-P2.50-D0.6-FD]  78.36 32.13 90 top
U76  Fuse_0.5A  [FUSE-TH_L8.9-W2.0-P5.00-D0.6-S0.80]  22.1 59.56 0 top
U77  1uF  [CAP-SMD_L3.5-W2.8-FD]  82.66 88.28 90 bottom
U78  1uF  [CAP-SMD_L3.5-W2.8-FD]  79.14 114.58 90 bottom
U79  1uF  [CAP-SMD_L3.5-W2.8-FD]  77.34 63.12 90 bottom
U80  1uF  [CAP-SMD_L3.5-W2.8-FD]  139.41 116.4 270 bottom
U81  1uF  [CAP-SMD_L3.5-W2.8-FD]  139.59 87.78 270 bottom
U82  -  [KAM0724]  107.82 -17.02 0 top

## Footprints (pads in the part's own frame, mm; a bottom-side part is the same pattern mirrored in y, then rotated)
C0805
  rect 1.41x1.35 smd: 1(-1,0) 2(1,0)
CAP-SMD_L3.5-W2.8-FD
  rect 1.9x2.376 smd: 1(-1.798,0) 2(1.798,0)
CAP-TH_BD6.3-P2.50-D0.6-FD
  round 1.75 hole 1.1: 1(-1.25,0) 2(1.25,0)
CAP-TH_BD18.0-P7.50-D1.2-FD
  round 2.2 hole 1.2: 1(-3.75,0) 2(3.75,0)
CONN-TH_YC0220500000G
  round 2.2 hole 1.4: 1(-2.54,0) 2(2.54,0)
FUSE-TH_L8.9-W2.0-P5.00-D0.6-S0.80
  round 1.5 hole 0.9: 1(-2.5,0.4) 2(2.5,-0.4)
HDR-TH_1P-P2.54-V-M
  rect 1.7x1.7 hole 1.1: 1(0,0)
HDR-TH_04P-P2.54-V-M-2
  rect 1.6x1.6 hole 1.05: 1(-5.08,0)
  round 1.6 hole 1.05: 2(-2.54,0) 3(0,0) 4(2.54,0)
IND-TH_BD9.0-P5.00-D0.7
  round 1.8 hole 1: 1(-2.5,0) 2(2.5,0)
KAM0724
  round 2 hole 1.5: 1(-48.631,49.688) 2(-48.631,29.688) 3(-95.631,57.188) 4(-95.631,39.688) 5(-95.631,22.188)
KEY-TH_DS1040-04RN
  round 1.6 hole 1: 1(-3.81,-3.81) 2(-1.27,-3.81) 3(1.27,-3.81) 4(3.81,-3.81) 5(3.81,3.81) 6(1.27,3.81) 7(-1.27,3.81) 8(-3.81,3.81)
Pad_e221
  round 4.5 hole 4: 1(0,0)
Pad_e222
  round 4.5 hole 4: 2(0,0)
Pad_e223
  round 4.5 hole 4: 3(0,0)
Pad_e224
  round 4.5 hole 4: 4(0,0)
R0603
  rect 0.806x0.864 smd: 1(-0.753,0) 2(0.753,0)
R1210
  rect 1.282x2.808 smd: 1(-1.441,0) 2(1.441,0)
R_AXIAL-0.4
  round 1.879 hole 0.899: 1(-5.08,0) 2(5.08,0)
RES-TH_BD8.0-L24.5-P28.50-D0.8
  round 2.5 hole 1.2: 1(-14.5,0) 2(14.5,0)
RES-TH_L12.5-W5.1-P7.50-D1.2-S2.20
  round 2 hole 1.2: 1(-3.749,1.1) 2(3.749,-1.1)
SENSOR-TH_LV25-P
  round 1.8 hole 1.2: 1(-7.62,-10.16) 2(0,-10.16) 3(7.62,-10.16)
  round 1.5 hole 0.9: 4(7.62,10.16) 5(-7.62,10.16)
SOIC-14_L8.7-W3.9-P1.27-LS6.0-BL
  oval 0.574x2.038 smd: 1(-3.81,-2.769) 2(-2.54,-2.769) 3(-1.27,-2.769) 4(0,-2.769) 5(1.27,-2.769) 6(2.54,-2.769) 7(3.81,-2.769) 8(3.81,2.769) 9(2.54,2.769) 10(1.27,2.769) 11(0,2.769) 12(-1.27,2.769) 13(-2.54,2.769) 14(-3.81,2.769)
SOT-23-3_L2.9-W1.3-P1.90-LS2.4-BR
  rect 1.25x0.7 smd: 1(1,-0.95) 2(1,0.95) 3(-1,0)
TEL_8_SERIES
  rect 2.54x2.54 hole 0.762: 1(0,-5.08) 16(0,5.08)
  round 1.27 hole 0.762: 7(15.24,-5.08)
  rect 1.27x2.54 hole 0.762: 8(17.78,-5.08) 9(17.78,5.08) 10(15.24,5.08)
TO-252-2_L6.6-W6.1-P4.57-LS9.9-BR-CW
  rect 3x1.6 smd: 1(3.424,-2.29) 3(3.424,2.29)
  rect 6.2x5.8 smd: 2(-3.424,0)

## Nets
As in the schematic.

Pads without a net: CN4 2 3 4; NOREF 2; NOREF#2 1; NOREF#3 4; NOREF#4 3; U24 7; U82 5

## Via types
v1: diameter 0.61, hole 0.305, Top Layer to Bottom Layer, 50 vias

## Routing (per net, layer and track width the routed paths; a pad name or vN(x,y) marks a point on that pad's centre or on a via; arc(x,y) is an arc through that point)
2.5V: length 193.8
  Top Layer w0.254: v1(83.57,134.53) 95.72,134.53 105.41,124.84 105.41,109.13 ; v1(96.39,81.79) 105.41,81.79 ; v1(94.87,110.87) 103.88,110.87 105.41,109.34 ; 105.41,109.34 105.41,73.72 111.18,67.95 139.7,67.95 140.97,66.67 140.97,62.36 142.62,60.71 P1.1 ; 105.41,109.34 109.99,113.92 v1(112.78,113.92) ; 105.41,83.06 105.54,83.19 v1(115.32,83.19)
  Bottom Layer w0.254: 83.57,133 v1(83.57,134.53) ; 85.47,80.42 86.83,81.79 v1(96.39,81.79) ; R23.2 89.15,105.16 v1(94.87,110.87) ; v1(112.78,113.92) 114.79,113.92 ; v1(115.32,83.19) 118.55,83.19 118.6,83.14
5V: length 148.8
  Top Layer w0.254: v1(118.11,50.6) v1(118.11,54.09) v1(118.11,60.17) 119.41,61.47 v1(138.05,61.47)
  Bottom Layer w0.254: U69.2 v1(118.11,54.09) ; U70.2 115.65,60.17 v1(118.11,60.17) ; v1(118.11,50.6) 118.11,6.73 ; CN7.1 121.67,1.7 CN1.1 119.38,6.73 97.66,6.73 95.76,8.64 95.76,23.11 94.96,23.91 R92.2 89.72,23.91 88.45,25.18 86.85,25.18 U59.2 ; U68.2 124.32,61.47 ; U71.2 v1(131.18,61.48) ; U72.2 138.03,61.48 v1(138.05,61.47)
  Bottom Layer w1.5: U75.1 81.14,30.88 U59.2
  vias: v1(124.29,61.47)
+15V: length 448.4
  Top Layer w0.5: 77.32,48.39 v1(77.32,57.53) ; U60.1 119.13,17.78 145.42,44.07 145.42,65.02 142.24,68.2 142.24,87.25 U47.2 142.06,93.93 142.06,116.14 144.87,118.95 U51.2
  Top Layer w1: U17.2 55.63,123.83 53.21,121.41 53.21,102.87 U66.2 53.21,92.2 53.21,76.58 U64.2 54.36,67.06 54.36,54.86 70.85,54.86 U60.1
  Top Layer w1.5: U24.9 107.93,14.3 U60.1
  Bottom Layer w0.254: U64.2 67.06,79.76 67.06,85.09 68.45,86.48 U77.1 83.46,87.28 C50.2 ; 77.38,61.29 79.58,61.29 80.17,61.88 ; 79.14,112.78 79.82,113.46 C51.2 84.63,113.46 85.6,114.43 85.6,121.53 86.17,122.1 U21.11 ; C52.2 87.25,61.96 88.25,62.96 88.25,69.2 88.86,69.81 U33.11 ; 85.3,87.2 91.26,87.2 91.82,87.76 91.82,94.62 92.13,94.93 U29.11 ; U46.11 130.23,88.93 130.63,88.52 134.11,88.52 134.5,88.91 138.92,88.91 U81.1 ; 129.29,118.87 130.71,117.45 C53.2 138.67,117.45 U80.1
  Bottom Layer w0.5: U66.2 72.52,111.51 77.87,111.51 79.14,112.78 ; v1(77.32,57.53) 77.38,57.58 77.38,61.29 ; U80.1 144.73,118.19 U51.2 ; U81.1 144.57,89.58 U47.2
GND: length 67.9
  Bottom Layer w0.254: v1(80.52,122.94) 80.95,123.37 U21.5 ; v1(82.68,70.74) 83.02,71.08 U33.5 ; v1(86.36,95.89) 86.67,96.2 U29.5 ; 91.63,120.19 v1(91.63,118.66) ; 93.3,68.55 v1(93.3,67.05) ; 93.66,115.27 v1(95,115.27) ; 95.08,64.01 v1(96.44,64.01) ; v1(96.01,93.47) 96.48,93.94 97.41,93.94 ; 99.12,89.46 v1(100.38,89.46) ; U70.1 v1(112.42,60.18) ; U69.1 v1(112.39,54.09) ; 120.02,121.95 v1(118.65,121.95) ; CN1.2 124.21,1.7 CN7.2 ; U53.5 128.12,112.54 v1(128.4,112.27) ; U46.5 128.96,83.26 v1(129.41,82.8) ; 131.1,123.69 131.1,122.39 v1(131.44,122.05) ; C32.2 132.59,94.26 v1(132.59,92.99) ; CN6.3 132.21,55.46 132.21,55.47 CN5.1 CN5.2 CN5.4 139.83,55.47 139.83,55.46 CN6.3 ; CN6.3 137.29,58.18 CN5.3 ; 135.38,125.67 v1(136.72,125.67) ; R78.1 v1(136.06,97.99) ; 139.09,80.78 144.89,80.78 U48.2 ; 139.14,109.23 144.89,109.23 U52.2 ; C49.2 139.12,80.72 ; C48.2 139.29,109.3
  vias: v1(94.74,46.48) v1(94.7,38.1) v1(104.14,46.48) v1(104.14,38.1) v1(106.55,134.42) v1(106.55,129.67) v1(113.11,46.48) v1(113.16,38.1) v1(113.92,134.37) v1(113.92,129.67)
$1N1815: length 11.1
  Bottom Layer w0.254: R93.1 69.64,116.2 R3.1 U17.1
$1N1976: length 8.9
  Top Layer w0.254: v1(79.25,122.01) v1(79.25,118.36)
  Bottom Layer w0.254: 79.25,123.28 v1(79.25,122.01) ; v1(79.25,118.36) 79.32,118.29 U21.1 U21.2
$1N2054: length 2.9
  Bottom Layer w0.254: R5.2 69.3,129.33 U5.1
$1N2080: length 2.9
  Bottom Layer w0.254: U5.2 71.84,129.33 R6.2
$1N2106: length 2.9
  Bottom Layer w0.254: R7.2 74.38,129.33 U5.3
$1N2182: length 2.9
  Bottom Layer w0.254: R8.2 76.92,129.33 U5.4
$1N3183: length 7.4
  Bottom Layer w0.254: U21.13 88.6,119.56 91.29,116.86 91.89,116.86 ; R13.1 R14.2
$1N3559: length 12.7
  Bottom Layer w0.254: 79.26,124.79 79.08,124.97 R8.1 R7.1 R6.1 R5.1 ; 79.25,124.71 79.32,124.64 U21.6
$1N6527: length 20.3
  Bottom Layer w0.254: R22.1 87.63,103.71 U26.5 U26.6 U26.7 U26.8 ; 87.58,101.17 87.84,100.91 U29.7
$1N6536: length 7.2
  Top Layer w0.254: v1(84.84,94.36) 84.84,93.09 v1(85.6,92.33)
  Bottom Layer w0.254: v1(84.84,94.36) 84.84,95.72 ; v1(85.6,92.33) 87.78,92.33 U29.2 U29.1
$1N6541: length 67.4
  Bottom Layer w0.254: 99.7,93.79 101.47,92.01 101.47,88.52 100.58,87.63 98.55,87.63 97.24,88.95 97.24,89.44 93.95,89.44 93.37,90.01 U29.14 93.46,91.2 93.98,91.2 ; 100.08,87.63 100.08,60.07 101.96,58.18 U70.3 121.66,58.18 CN3.1
$1N6548: length 6.3
  Bottom Layer w0.254: U29.13 94.68,92.39 96.04,91.03 97.24,91.03 ; R27.2 99.11,90.99 R26.1
$1N7416: length 14.2
  Bottom Layer w0.254: 70.35,72.4 77.97,72.4 ; R34.1 84.11,72.44 84.3,72.25 U33.6
$1N7419: length 20.8
  Bottom Layer w0.254: U30.8 U30.5 84,78.09 84,76.87 ; U33.7 84.04,73.98 R35.1
$1N7428: length 8.5
  Top Layer w0.254: v1(80.9,69.47) 80.9,67.69 v1(81.92,66.8)
  Bottom Layer w0.254: R30.1 v1(80.9,69.47) ; v1(81.92,66.8) 82.38,67.27 U33.2 U33.1
$1N10154: length 2.6
  Bottom Layer w0.254: R72.2 U43.4
$1N10155: length 14.4
  Bottom Layer w0.254: U46.6 127.69,80.08 127.8,79.97 ; 127.8,79.97 129.68,79.97 R68.2 ; 127.8,79.97 127.8,72.35
$1N10157: length 2.6
  Bottom Layer w0.254: R71.2 U43.3
$1N10158: length 2.6
  Bottom Layer w0.254: R70.2 U43.2
$1N10180: length 2.6
  Bottom Layer w0.254: R69.2 U43.1
$1N10182: length 8
  Top Layer w0.254: v1(132.47,79.96) 134.04,81.53 v1(134.04,82.93)
  Bottom Layer w0.254: 131.24,79.96 v1(132.47,79.96) ; U46.2 U46.1 v1(134.04,82.93)
$1N20202: length 7.3
  Top Layer w0.254: v1(129.55,110.82) 130.43,110.82 v1(131.93,112.33)
  Bottom Layer w0.254: 128.31,110.82 v1(129.55,110.82) ; v1(131.93,112.33) U53.2 U53.1
$1N20203: length 2.9
  Bottom Layer w0.254: R81.2 120.31,103.17
$1N20204: length 2.9
  Bottom Layer w0.254: R82.2 120.31,105.71
$1N20205: length 2.9
  Bottom Layer w0.254: R83.2 120.31,108.25
$1N20206: length 2.9
  Bottom Layer w0.254: R84.2 120.31,110.79
$1N41685: length 9.5
  Bottom Layer w0.254: 68.96,63.59 66.93,63.59 ; R95.1 U64.1
$1N42087: length 10.9
  Bottom Layer w0.254: 69.34,89.79 R98.1 65.66,89.79 65.66,89.85 65.6,89.92 U66.1
$1N42100: length 20.9
  Bottom Layer w0.254: U29.3 87.82,93.67 C47.1 R99.2
$1N42167: length 16.4
  Bottom Layer w0.254: 130.66,114.84 U53.3 130.66,110.51 134.11,107.06 139.05,107.06 C48.1 138.9,106.91 R100.2
$1N42233: length 13.5
  Bottom Layer w0.254: U46.3 131.5,83.26 136.13,78.62 139.09,78.62 ; R101.2 138.91,76.57 138.91,78.7 C49.1
-15V: length 470.6
  Top Layer w0.5: U61.2 98.83,11.66 102.87,7.62 128.52,7.62 147.95,27.05 147.95,82.96 U47.1 148.46,88.39 148.46,110.9 U51.1
  Bottom Layer w0.254: U64.3 67.56,87.88 78.74,87.88 80.64,89.79 82.37,89.79 U77.2 83.39,89.35 88.46,89.35 89.79,90.68 89.79,93.76 88.63,94.93 ; 77.38,64.88 79.32,64.88 80.17,64.04 ; U78.2 79.99,115.53 81.94,115.53 ; C52.1 80.28,64.06 81.97,64.06 82.79,63.25 85.6,63.25 85.98,63.63 85.98,69.47 85.64,69.81 U33.4 ; C51.1 83.58,117.1 83.58,121.91 82.06,121.91 U21.4 ; 130.23,85.68 130.23,86.1 131.28,87.15 134.19,87.15 134.58,86.76 136.79,86.76 ; 129.41,114.94 130.3,115.82 134.37,115.82 134.74,115.45 C53.1 138.56,115.45 U80.2 ; 136.8,86.83 138.74,86.83 U81.2
  Bottom Layer w0.5: U66.3 67.06,113.66 72.77,113.66 74.42,116.2 79.11,116.2 ; 73.53,49.4 73.53,63.37 75.08,64.92 U79.2 ; U80.2 144.76,114.6 U51.1 ; U81.2 144.93,85.98 U47.1
  Bottom Layer w1: U17.3 56.01,131.44 51.56,127 51.56,112.14 U66.3 56.13,105.16 51.82,100.84 51.82,85.6 U64.3 51.44,71.75 51.44,56.13 56.13,51.44 71.25,51.44 98.83,23.86 U61.2
  Bottom Layer w1.5: U61.2 98.83,16.84 U24.10
CS: length 2.8
  Bottom Layer w0.254: CN2.3 CN8.3
DINOUT: length 8.7
  Bottom Layer w0.254: 132.21,1.65 CN7.4 129.29,1.7 CN1.4 132.21,4.44
DRDY: length 2.8
  Bottom Layer w0.254: CN2.2 CN8.2
NET8: length 2.8
  Bottom Layer w0.254: 139.83,4.44 139.83,1.65
SCLK: length 2.8
  Bottom Layer w0.254: CN1.3 126.75,1.7 CN7.3
$1N2231: length 20.9
  Bottom Layer w0.254: U5.8 U5.5 82.08,131.8 82.08,129.37 81.88,129.17 U21.7
$1N2651: length 11.5
  Bottom Layer w0.254: 83.59,131.41 83.59,124.06 84.33,123.32 87.37,123.32 U21.10
$1N3069: length 6.6
  Bottom Layer w0.254: 91.63,125.88 92.04,125.88 94.03,123.88 94.03,122.35 ; 91.65,127.69 91.65,125.88
$1N3119: length 6.8
  Bottom Layer w0.254: U21.12 89.08,120.83 90.53,122.27 C1.1 ; 91.63,124.29 91.63,122.35
$1N4476: length 92.4
  Bottom Layer w0.254: U21.14 87.42,116.16 88.27,115.32 91.88,115.32 R13.2 ; 91.89,115.27 91.89,114.11 92.84,113.16 95.5,113.16 96.01,113.66 ; 94.05,120.19 96.01,118.23 96.01,113.66 ; 96.01,113.66 96.88,113.66 104.77,105.77 104.77,97.03 105.79,96.01 105.79,80.77 106.81,79.76 106.81,74.04 110.36,70.48 110.36,68.07 114.55,63.88 U68.3 122.32,60.69 122.81,60.2 122.81,59.58 CN3.2
$1N5599: length 9.5
  Top Layer w1.5: U57.1 14.75,59.96 U76.1
$1N5603: length 42.5
  Bottom Layer w1.5: U57.2 14.92,48.07 R113.1 22.78,33 12.45,22.67
$1N6524: length 13.2
  Bottom Layer w0.254: R18.1 R21.1 ; 82.29,97.33 87.7,97.33 U29.6
$1N6525: length 2.6
  Bottom Layer w0.254: U26.1 74.67,101.43 R18.2
$1N6528: length 2.5
  Bottom Layer w0.254: U26.3 79.75,101.43 79.75,98.92
$1N6529: length 2.5
  Bottom Layer w0.254: U26.2 77.21,101.43 77.21,98.92
$1N6533: length 2.5
  Bottom Layer w0.254: U26.4 82.29,101.43 82.29,98.92
$1N6538: length 10.7
  Bottom Layer w0.254: R22.2 89.15,101.19 89.15,103.22 ; 89.17,101.17 89.54,100.8 89.54,96.77 90.11,96.2 U29.10
$1N6553: length 6.9
  Bottom Layer w0.254: R24.2 97.41,101.34 97.41,99.47 98.41,99.47 99.82,98.06 C13.2
$1N6559: length 6.8
  Bottom Layer w0.254: U29.12 94.04,93.66 96.27,95.89 97.42,95.89 ; 97.41,97.88 97.41,96.03 C12.1
$1N7417: length 1.9
  Bottom Layer w0.254: 70.35,73.99 70.35,75.9
$1N7420: length 1.8
  Bottom Layer w0.254: 75.43,73.99 75.43,75.77
$1N7421: length 1.8
  Bottom Layer w0.254: 72.89,73.99 72.89,75.77
$1N7425: length 1.8
  Bottom Layer w0.254: 77.97,73.99 77.98,74.01 77.98,75.77
$1N7430: length 11
  Bottom Layer w0.254: 85.51,76.86 85.51,78.83 ; 85.59,76.87 86.36,76.1 86.36,72.14 87.42,71.08 U33.10
$1N7440: length 5.9
  Bottom Layer w0.254: U33.13 90.84,67.27 91.92,66.19 92.54,66.19 R39.1 R40.2
$1N7445: length 6.9
  Bottom Layer w0.254: R37.2 93.34,74.15 94.13,74.15 95.72,72.55 C18.2
$1N7451: length 6.1
  Bottom Layer w0.254: 89.9,68.54 91.13,68.54 93.3,70.71 93.3,72.47 93.35,72.52
$1N10156: length 20.6
  Bottom Layer w0.254: U43.8 U43.5 121.74,79.97 123.45,81.68 R73.1 ; 123.49,83.14 125.43,83.14 126.49,84.2
$1N10167: length 7.1
  Bottom Layer w0.254: R75.2 124.52,94.86 126.38,94.86 ; R76.1 126.38,94.9 126.38,95.9 127.75,97.27 C33.2
$1N10186: length 7.1
  Bottom Layer w0.254: U46.13 132.77,91.24 133.99,92.46 133.99,94.31 134.51,94.83 134.51,96.76
$1N10198: length 7.1
  Bottom Layer w0.254: 129.91,94.86 129.91,94.12 131.44,92.58 131.44,90.44 U46.12 ; C32.1 127.97,94.86
$1N10199: length 12.5
  Bottom Layer w0.254: 121.9,83.14 120.19,83.14 ; R73.2 125.29,86.49 127.38,86.49 128.9,88.01 128.9,89.79
$1N17336: length 28
  Top Layer w1.5: 12.45,40.17 18.54,46.27 18.54,55.63 24.92,55.63 R113.2 24.6,55.94 24.6,58.95
$1N20207: length 22.6
  Bottom Layer w0.254: U49.8 U49.5 117.95,110.79 119.71,112.55 119.71,113.85 119.75,113.89 125.4,113.89 U53.7
$1N20209: length 15.3
  Bottom Layer w0.254: R86.1 116.36,113.89 R85.2 ; 118.16,113.89 120.47,116.2 127.76,116.2 128.14,116.59 128.14,118.87
$1N20211: length 6.9
  Bottom Layer w0.254: 123.64,123.47 123.65,123.45 125.38,123.45 125.38,124.21 127.35,126.17 128.94,126.17
$1N20212: length 6.1
  Bottom Layer w0.254: 126.97,123.45 128.71,123.45 128.95,123.69 ; C37.1 129.03,122.69 130.68,121.03 130.68,120.4
$1N20213: length 6.8
  Bottom Layer w0.254: U53.13 131.93,120.85 133.68,122.6 133.68,123.78 133.79,123.89 133.79,125.67
$1N20216: length 12.2
  Bottom Layer w0.254: 124.67,103.17 124.67,110.79 126.72,110.79 ; 126.87,113.28 126.77,113.18 R80.2
$1N20370: length 7.8
  Top Layer w1.5: U55.1 12.32,81.66 R2.1
$1N20734: length 5.9
  Bottom Layer w0.254: U59.1 92.26,18.4 ; R91.2 R92.1
$1N23806: length 33.1
  Top Layer w1.5: 59.45,12.67 66.65,5.46 C44.2 79.02,2.13 U24.1
$1N36258: length 18.9
  Top Layer w1.5: 59.45,32.41 65.86,26 L4.1
$1N36284: length 37
  Top Layer w1.5: C44.1 L4.2
  Bottom Layer w1.5: U74.1 71.76,24.93 L4.2 81.89,21 U59.3 84.49,15.94 U24.16
$1N41392: length 14.8
  Bottom Layer w0.254: 69.72,117.73 69.6,117.86 69.6,119.7 79.06,119.7 80.14,120.78 81.83,120.78 U21.3
$1N41681: length 18
  Bottom Layer w0.254: R96.2 68.96,67.12 ; 68.96,67.2 80.03,67.2 81.37,68.54 U33.3
$1N41683: length 83.3
  Top Layer w1.5: U17.5 40.51,113.92 40.51,92.33 38.23,90.04 U66.5 40.51,87.63 40.51,65.66 38.48,63.63 U64.5
  Bottom Layer w1.5: U64.5 U67.2
$1N42093: length 22.4
  Top Layer w1.5: R97.2 32.92,105.16 U66.4
$1N42170: length 6.6
  Bottom Layer w0.254: R100.1 145.45,103.59 U52.1
$1N42236: length 6.7
  Bottom Layer w0.254: 138.85,74.97 145.37,74.97 U48.1
$1N84415: length 42.1
  Bottom Layer w1.5: R94.2 29.21,93.47 33.02,89.66 33.02,84.07 U64.4
$1N84418: length 23
  Bottom Layer w1.5: U55.2 16.66,75.69 R94.1
$1N84441: length 31.8
  Top Layer w1.5: R2.2 26.52,131.44 U17.4
$1N84474: length 23.4
  Top Layer w1.5: R97.1 20.83,78.11 U67.1
$1N102670: length 55.3
  Bottom Layer w0.254: 93.17,64.01 90.3,64.01 89.94,64.37 U33.14 89.97,65.96 90.7,65.96 ; R39.2 93.17,63.54 94.61,62.1 97.15,62.1 97.92,62.86 97.92,66.36 95.72,68.55 ; 96.39,62.09 96.39,54.23 98.54,52.09 114.63,52.09 ; U69.3 120.65,52.09 121.67,53.1 CN4.1
$1N108532: length 76.8
  Bottom Layer w0.254: CN3.4 131.17,60.07 131.83,60.07 135.64,63.88 U72.3 136.02,63.9 136.02,67.69 137.29,68.96 144.65,68.96 148.46,72.77 148.46,93.73 146.56,95.63 137.8,95.63 ; C33.1 133.78,99.06 137.16,99.06 137.8,98.42 137.8,95.63 ; U46.14 136.1,92.45 136.1,94.83 137,94.83 137.8,95.63
$1N108540: length 125.6
  Bottom Layer w0.254: CN3.3 126.75,59.69 128.02,60.96 128.02,62.72 U71.3 123.59,69.47 115.82,69.47 112.14,73.15 112.14,100.33 108.97,103.5 108.97,120.02 117.98,129.03 130.2,129.03 131.09,128.14 131.09,126.17 133.44,128.52 137.54,128.52 138.94,127.13 138.94,124.97 137.86,123.89 135.38,123.89 135.38,120.27 134.75,119.63 133.22,119.63 U53.14
$1N114348: length 9.8
  Bottom Layer w0.254: U21.9 86.05,124.64 85.47,125.22 85.47,127 88.01,129.54 88.45,129.54 88.45,131.31
$1N114352: length 5.3
  Bottom Layer w0.254: U21.8 89.2,127.69 R11.1 ; R114.2 90.06,129.48 90.06,127.69
$1N114492: length 10.3
  Bottom Layer w0.254: U29.9 92.02,97.47 91.44,98.04 91.44,99.31 92.33,100.2 92.33,101.28 94.3,103.25 94.3,105.01
$1N114496: length 5.5
  Bottom Layer w0.254: U29.8 93.37,98.87 95.85,101.35 95.85,103.24 95.85,103.25
$1N114708: length 10.5
  Bottom Layer w0.254: 120.9,91.66 122.68,91.66 122.68,88.77 123.19,88.27 126.11,88.27 127.64,89.79
$1N114712: length 5.5
  Bottom Layer w0.254: 122.68,93.3 124.51,93.3 124.51,92.29 U46.8
$1N114721: length 10.2
  Bottom Layer w0.254: R121.2 121.79,120.4 ; 121.79,120.36 121.79,117.86 122.3,117.35 125.35,117.35 126.87,118.87
$1N114725: length 5
  Bottom Layer w0.254: R120.2 121.8,121.92 123.64,121.92 123.64,121.56 U53.8
$1N114740: length 9.8
  Bottom Layer w0.254: U33.9 88.81,72.35 88.14,73.03 88.14,74.8 90.26,76.93 90.26,79.88
$1N114744: length 5.3
  Bottom Layer w0.254: U33.8 89.94,74.18 R37.1 91.83,78.09 R118.2

## Copper pours and planes (outline as drawn; the poured copper is in the pictures)
GND on Top Layer: 61.6,137.29 148.46,137.29 148.46,0.76 61.6,0.76
GND on Bottom Layer: 61.6,137.29 148.46,137.29 148.46,0.76 61.6,0.76
